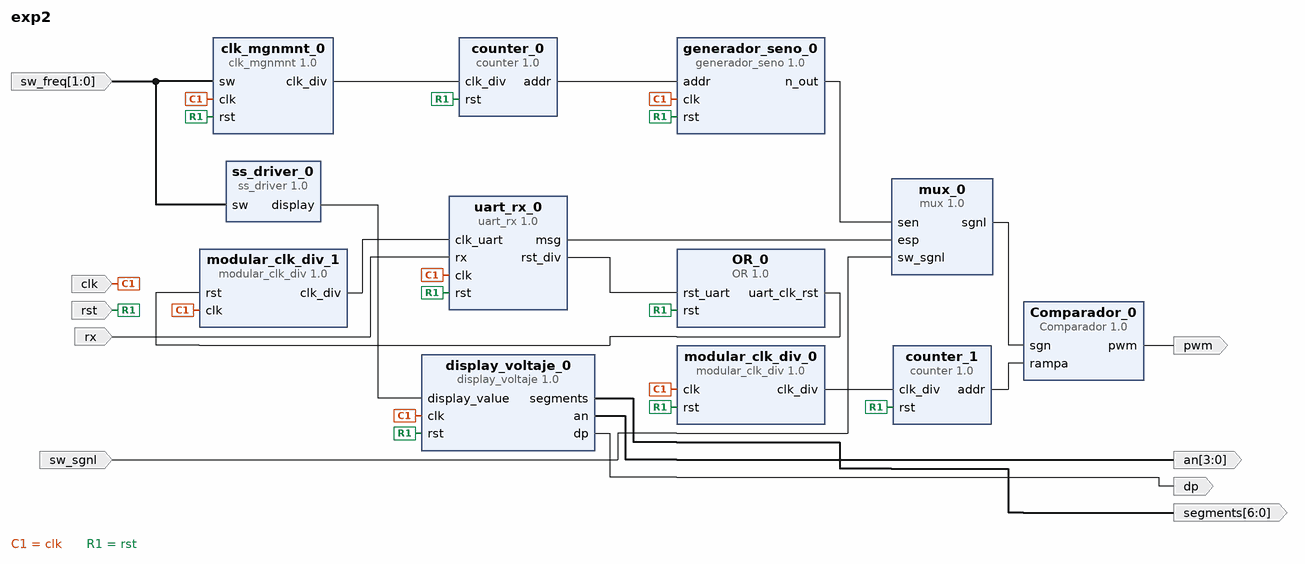
[diagram p0: block diagram of the top level]
# Vivado block design exp2, xc7a35tcpg236-1, Vivado 2020.1
create_bd_design exp2

create_bd_port -dir I -type clk clk
create_bd_port -dir I -type rst rst
create_bd_port -dir I -from 1 -to 0 sw_freq
create_bd_port -dir I sw_sgnl
create_bd_port -dir O pwm
create_bd_port -dir I rx
create_bd_port -dir O -from 6 -to 0 segments
create_bd_port -dir O -from 3 -to 0 an
create_bd_port -dir O dp

create_bd_cell -type ip -vlnv xilinx.com:user:counter:1.0 counter_0
create_bd_cell -type ip -vlnv xilinx.com:user:mux:1.0 mux_0
create_bd_cell -type ip -vlnv xilinx.com:user:Comparador:1.0 Comparador_0
create_bd_cell -type ip -vlnv xilinx.com:user:counter:1.0 counter_1
create_bd_cell -type ip -vlnv xilinx.com:user:modular_clk_div:1.0 modular_clk_div_0
create_bd_cell -type ip -vlnv xilinx.com:user:clk_mgnmnt:1.0 clk_mgnmnt_0
create_bd_cell -type ip -vlnv xilinx.com:user:uart_rx:1.0 uart_rx_0
create_bd_cell -type ip -vlnv xilinx.com:user:modular_clk_div:1.0 modular_clk_div_1
set_property -dict {CONFIG.N 434} [get_bd_cells modular_clk_div_1]
create_bd_cell -type ip -vlnv xilinx.com:user:OR:1.0 OR_0
create_bd_cell -type ip -vlnv xilinx.com:user:ss_driver:1.0 ss_driver_0
create_bd_cell -type ip -vlnv xilinx.com:user:display_voltaje:1.0 display_voltaje_0
create_bd_cell -type ip -vlnv xilinx.com:user:generador_seno:1.0 generador_seno_0

# ---- connections ----

connect_bd_net -net clk_0_1 [get_bd_ports clk] \
  [get_bd_pins modular_clk_div_0/clk] [get_bd_pins clk_mgnmnt_0/clk] [get_bd_pins uart_rx_0/clk] \
  [get_bd_pins modular_clk_div_1/clk] [get_bd_pins display_voltaje_0/clk] [get_bd_pins generador_seno_0/clk]
connect_bd_net -net rst_0_1 [get_bd_ports rst] \
  [get_bd_pins counter_0/rst] [get_bd_pins counter_1/rst] [get_bd_pins modular_clk_div_0/rst] [get_bd_pins clk_mgnmnt_0/rst] \
  [get_bd_pins uart_rx_0/rst] [get_bd_pins OR_0/rst] [get_bd_pins display_voltaje_0/rst] [get_bd_pins generador_seno_0/rst]
connect_bd_net -net sw_0_1 [get_bd_ports sw_freq] [get_bd_pins clk_mgnmnt_0/sw] [get_bd_pins ss_driver_0/sw]
connect_bd_net [get_bd_pins clk_mgnmnt_0/clk_div] [get_bd_pins counter_0/clk_div]
connect_bd_net [get_bd_pins counter_0/addr] [get_bd_pins generador_seno_0/addr]
connect_bd_net [get_bd_pins generador_seno_0/n_out] [get_bd_pins mux_0/sen]
connect_bd_net -net sw_sgnl_0_1 [get_bd_ports sw_sgnl] [get_bd_pins mux_0/sw_sgnl]
connect_bd_net [get_bd_pins mux_0/sgnl] [get_bd_pins Comparador_0/sgn]
connect_bd_net [get_bd_pins counter_1/addr] [get_bd_pins Comparador_0/rampa]
connect_bd_net [get_bd_pins modular_clk_div_0/clk_div] [get_bd_pins counter_1/clk_div]
connect_bd_net [get_bd_pins Comparador_0/pwm] [get_bd_ports pwm]
connect_bd_net [get_bd_pins uart_rx_0/msg] [get_bd_pins mux_0/esp]
connect_bd_net -net rx_0_1 [get_bd_ports rx] [get_bd_pins uart_rx_0/rx]
connect_bd_net [get_bd_pins modular_clk_div_1/clk_div] [get_bd_pins uart_rx_0/clk_uart]
connect_bd_net [get_bd_pins OR_0/uart_clk_rst] [get_bd_pins modular_clk_div_1/rst]
connect_bd_net [get_bd_pins uart_rx_0/rst_div] [get_bd_pins OR_0/rst_uart]
connect_bd_net [get_bd_pins ss_driver_0/display] [get_bd_pins display_voltaje_0/display_value]
connect_bd_net [get_bd_pins display_voltaje_0/segments] [get_bd_ports segments]
connect_bd_net [get_bd_pins display_voltaje_0/an] [get_bd_ports an]
connect_bd_net [get_bd_pins display_voltaje_0/dp] [get_bd_ports dp]

validate_bd_design
save_bd_design
